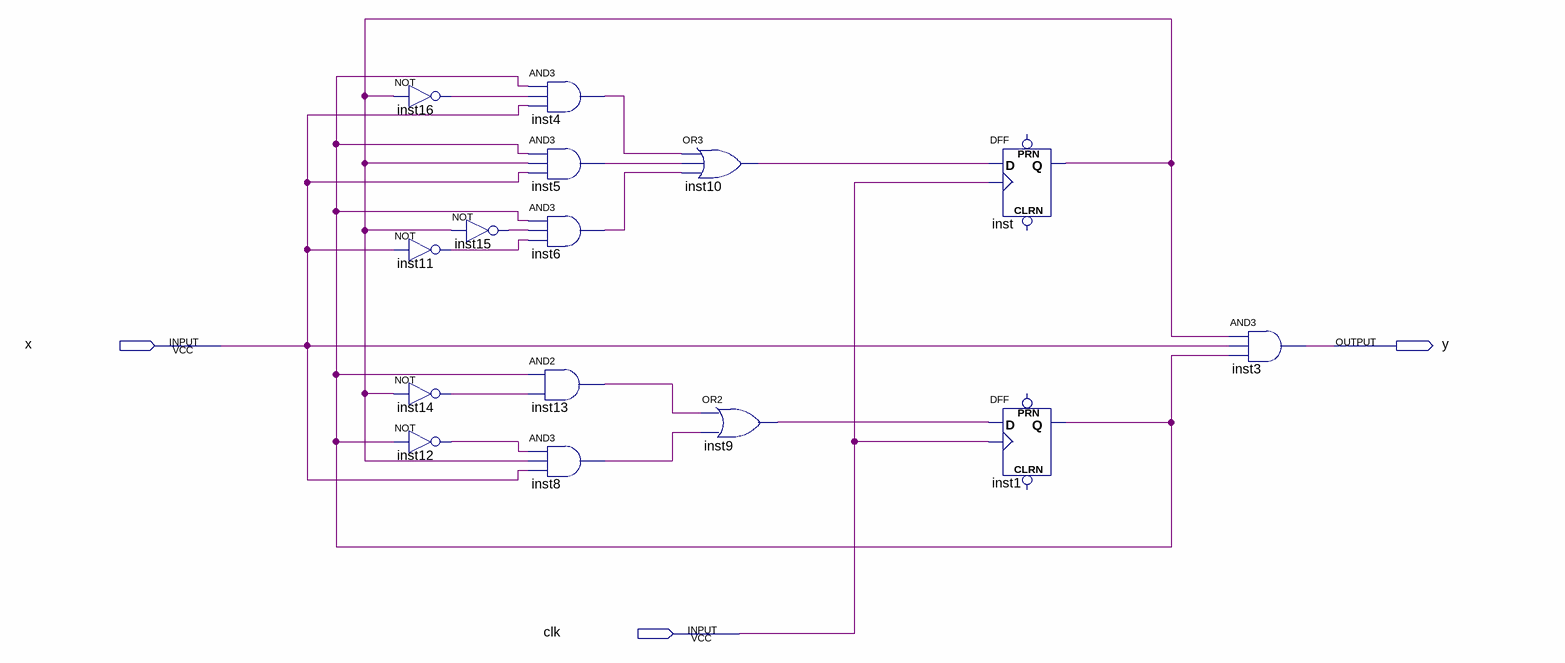
[diagram p0: schematic sheet]
// Quartus schematic SecDec1101.bdf as structural Verilog: 15 symbols, 3 pins
module SecDec1101 (
  input  x,
  input  clk,
  output y
);

  wire inst1_q, inst4_out, inst5_out, inst6_out, inst8_out, inst9_out, inst10_out, inst11_out, inst12_out,
       inst13_out, inst14_out, inst15_out, inst16_out, inst_q;

  not inst16 (inst16_out, inst_q);
  not inst15 (inst15_out, inst_q);
  not inst11 (inst11_out, x);
  not inst14 (inst14_out, inst_q);
  not inst12 (inst12_out, inst1_q);
  and inst4 (inst4_out, inst1_q, inst16_out, x);
  and inst5 (inst5_out, inst1_q, inst_q, x);
  and inst6 (inst6_out, inst1_q, inst15_out, inst11_out);
  and inst13 (inst13_out, inst1_q, inst14_out);
  and inst8 (inst8_out, inst12_out, inst_q, x);
  or inst10 (inst10_out, inst4_out, inst5_out, inst6_out);
  or inst9 (inst9_out, inst13_out, inst8_out);
  DFF inst (.CLK(clk), .D(inst10_out), .Q(inst_q));  // open: CLRN, PRN
  DFF inst1 (.CLK(clk), .D(inst9_out), .Q(inst1_q));  // open: CLRN, PRN
  and inst3 (y, inst_q, x, inst1_q);
endmodule
